# EAGLE schematic SumoBot (EAGLE 9.5.1)
AUTHOR: RYAN FORSBERG; BOARD_NAME: SUMO; DOC_NUM: 000; PROJECT_NAME: SUMO BOT FINAL PROJECT; REVISION: 1

## Sheet 1 of 2: Power and Clock
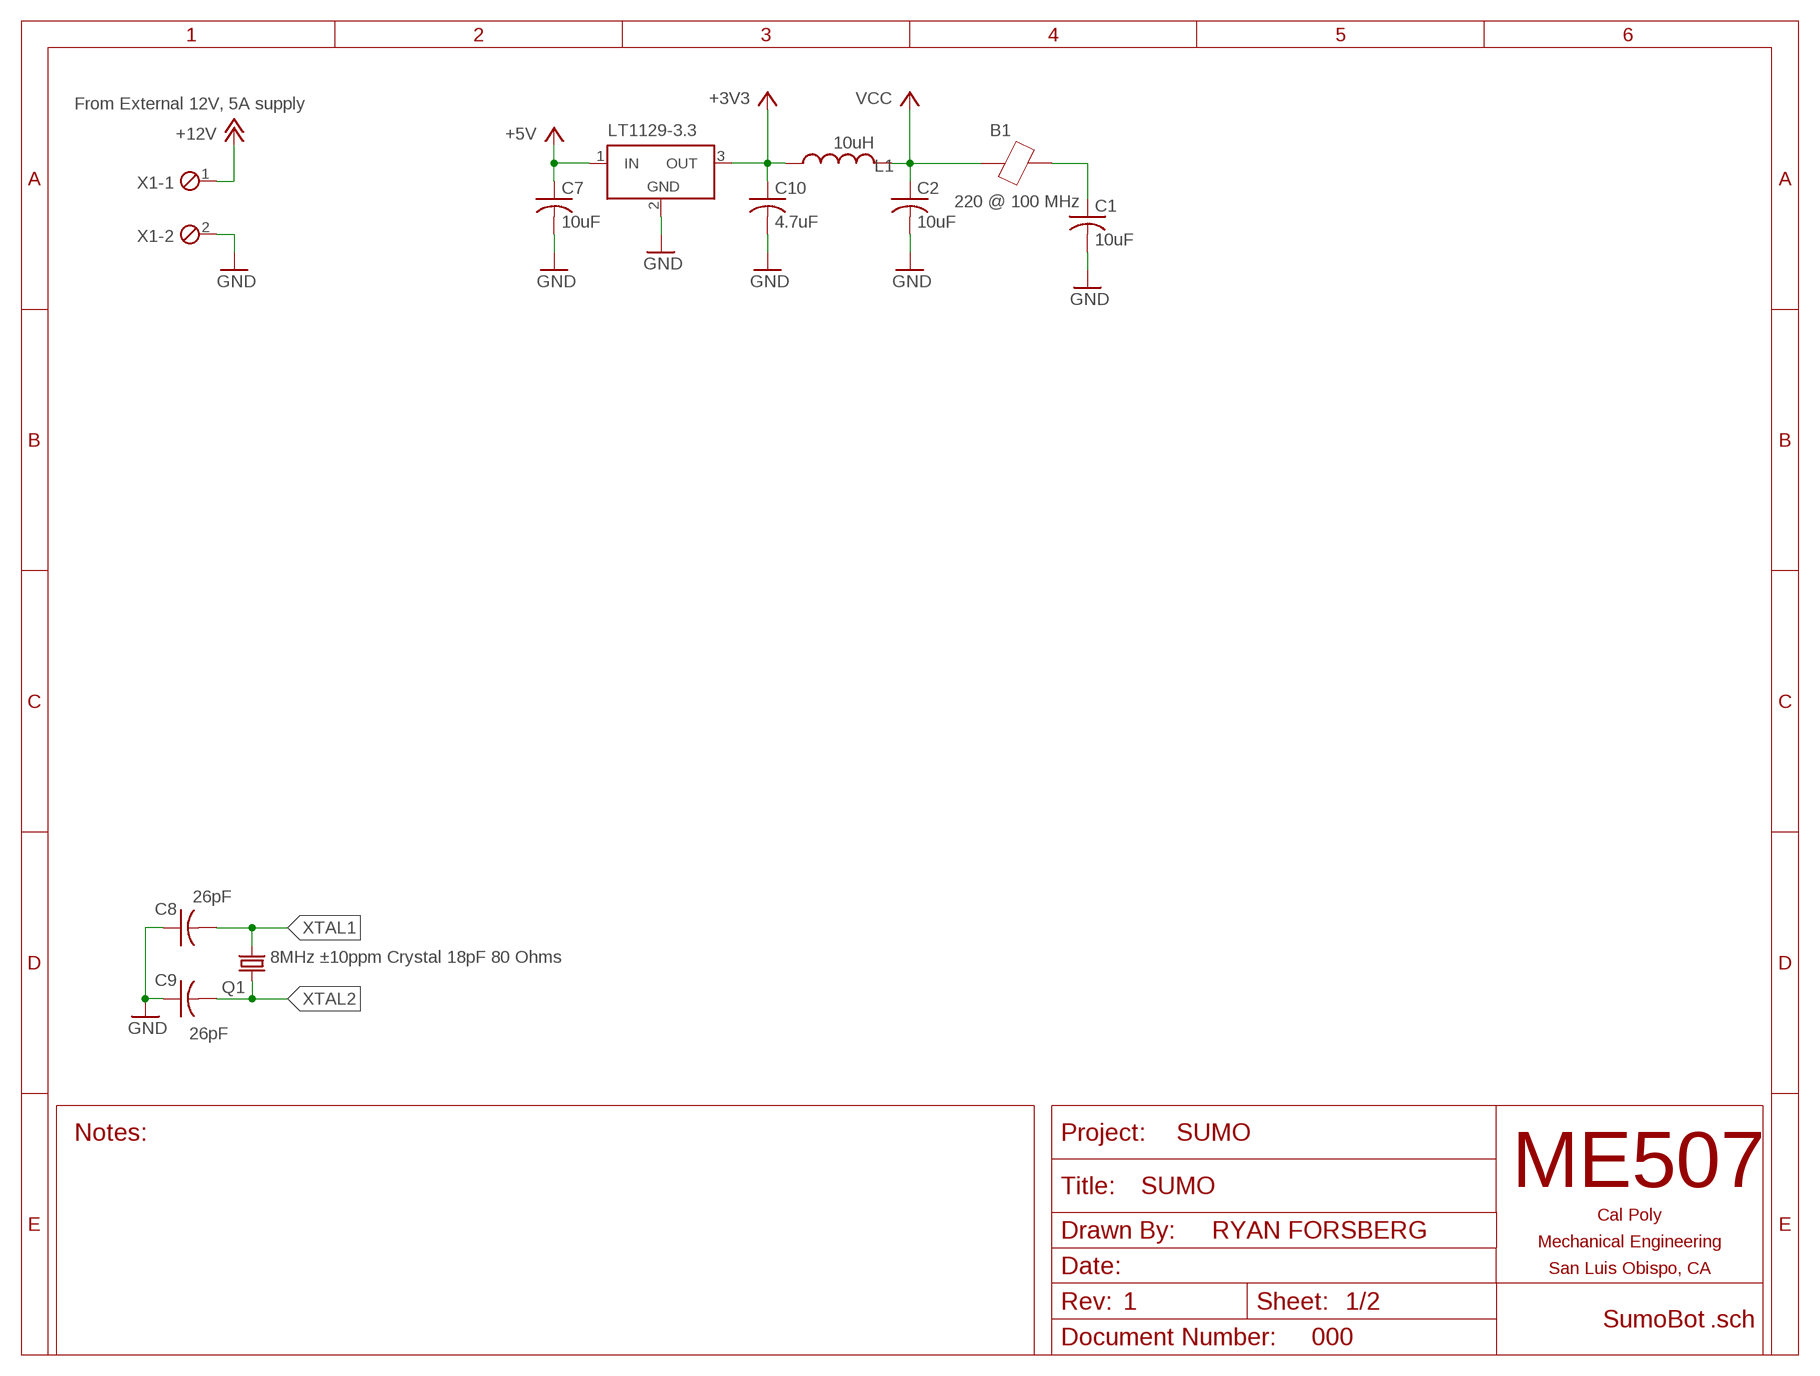
[diagram p0: schematic, sheet 1]
FRAME1 (TITLEBLOCK_LET_L): PROJECT_NAME: SUMO

### Parts
B1  220 @ 100 MHz  BEAD1210  [1210]
C1  10uF  C-USC0805  [C0805]
C2  10uF  C-USC0805  [C0805]
C7  10uF  C-USC0805  [C0805]
C8  26pF  C-USC0805  [C0805]
C9  26pF  C-USC0805  [C0805]
C10  4.7uF  C-USC0805  [C0805]
L1  10uH  L-USL3225M  [L3225M]
LT1129-3.3  LT1129CST5  [SOT223]
Q1  8MHz ±10ppm Crystal 18pF 80 Ohms  CRYSTALHC49UP  [HC49UP]
X1  SCREWTERM_2P_381  [2POL381]

### Nets
5V: C7.1 LT1129-3.3.1(IN) ; supply symbol labelled +5V
+3V3: C10.1 L1.1 LT1129-3.3.3(OUT)
+12V: X1.1
GND: C1.2 C2.2 C7.2 C8.1 C9.1 C10.2 LT1129-3.3.2(GND) X1.2
N$48: B1.2 C1.1
VCC: B1.1 C2.1 L1.2
XTAL1: C8.2 Q1.2
XTAL2: C9.2 Q1.1

### Notes on the sheet
- From External 12V, 5A supply

## Sheet 2 of 2: Edge Detection
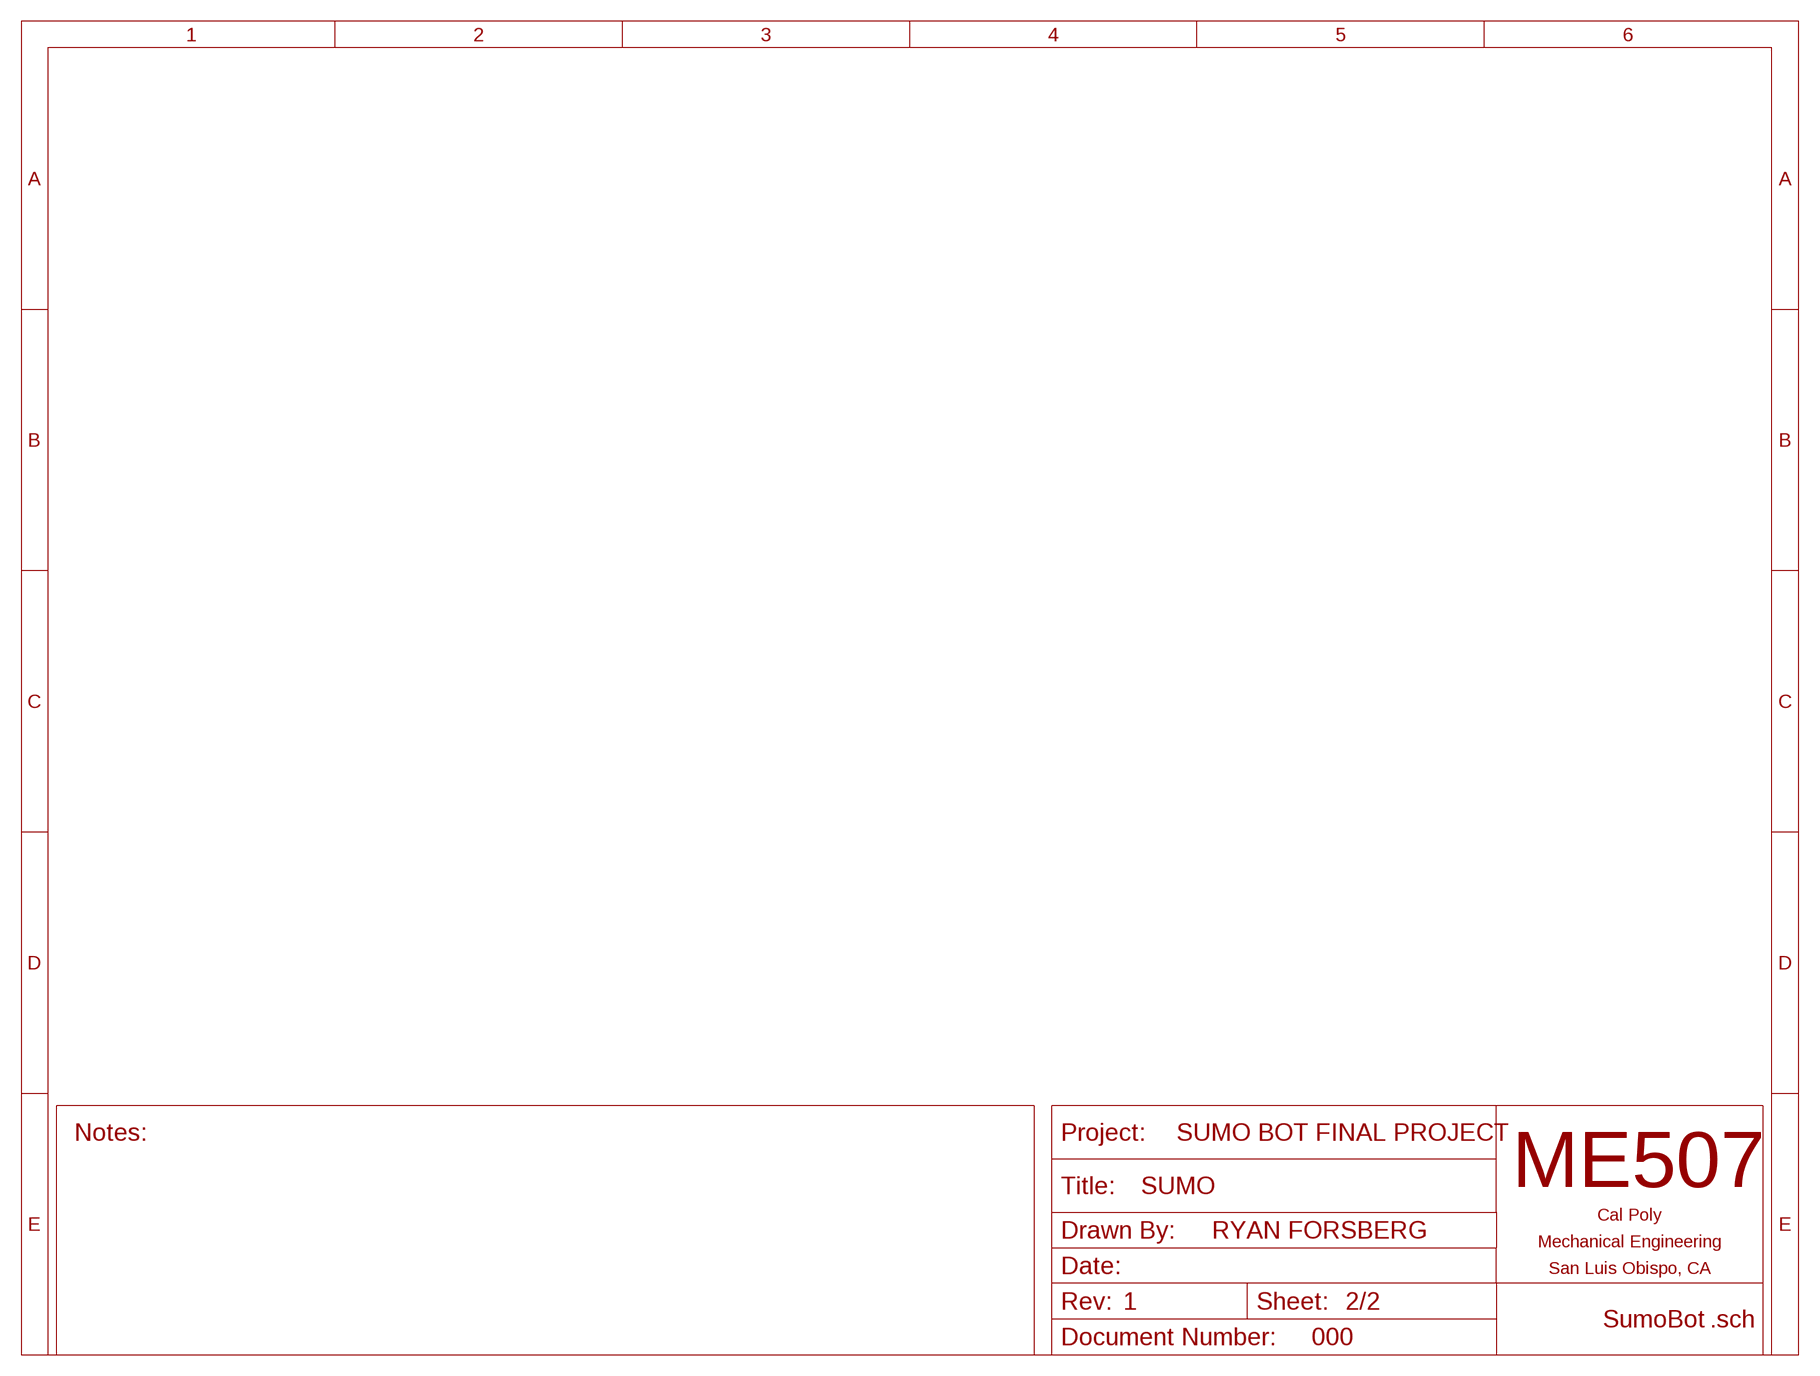
[diagram p1: schematic, sheet 2]

## Power pins joined to a net without a drawn wire
GND: LT1129-3.3.4(GND)

## Library data of the parts
B1 = ME507:BEAD: Ferrite Bead
C1 C2 C7-C10 = rcl:C-US: CAPACITOR, American symbol; SPICEPREFIX: C
L1 = rcl:L-US: INDUCTOR, American symbol; SPICEPREFIX: L
LT1129-3.3 = linear-technology:LT1129CST5: VOLTAGE REGULATOR with shutdown; MPN: LT1129CST-5#PBF; OC_FARNELL: 1663375; OC_NEWARK: 57M2069
Q1 = crystal:CRYSTAL: CRYSTAL; OC_FARNELL: unknown; OC_NEWARK: unknown; PN: 887-1263-1-ND
X1 = ME507:SCREWTERM_2P: PHOENIX CONNECTOR